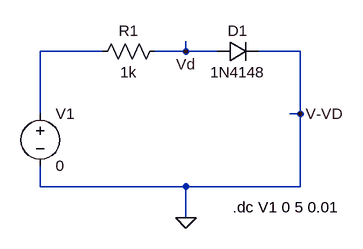
[diagram p0: schematic Diode_VI_Characteristics.asc]
Diode_VI_Characteristics.asc, the LTspice schematic file:
Version 4.1
SHEET 1 880 680
WIRE 160 16 64 16
WIRE 288 16 288 0
WIRE 288 16 240 16
WIRE 336 16 288 16
WIRE 464 16 400 16
WIRE 64 112 64 16
WIRE 464 112 464 16
WIRE 464 112 448 112
WIRE 64 224 64 192
WIRE 288 224 64 224
WIRE 464 224 464 112
WIRE 464 224 288 224
WIRE 288 272 288 224
FLAG 288 272 0
FLAG 288 16 Vd
FLAG 464 112 V-VD
SYMBOL voltage 64 96 R0
WINDOW 123 0 0 Left 0
WINDOW 39 0 0 Left 0
SYMATTR InstName V1
SYMATTR Value 0
SYMBOL res 256 0 R90
WINDOW 0 0 56 VBottom 2
WINDOW 3 32 56 VTop 2
SYMATTR InstName R1
SYMATTR Value 1k
SYMBOL diode 336 32 R270
WINDOW 0 32 32 VTop 2
WINDOW 3 0 32 VBottom 2
SYMATTR InstName D1
SYMATTR Value 1N4148
TEXT 360 256 Left 2 !.dc V1 0 5 0.01

The netlist it stands for:
* Diode_VI_Characteristics.asc
V1 N001 0 0
R1 Vd N001 1k
D1 Vd 0 1N4148
.model D D
.lib standard.dio
.dc V1 0 5 0.01
.backanno
.end